# EAGLE schematic Mayfly_v1p0_revA3_public (EAGLE 9.6.2)
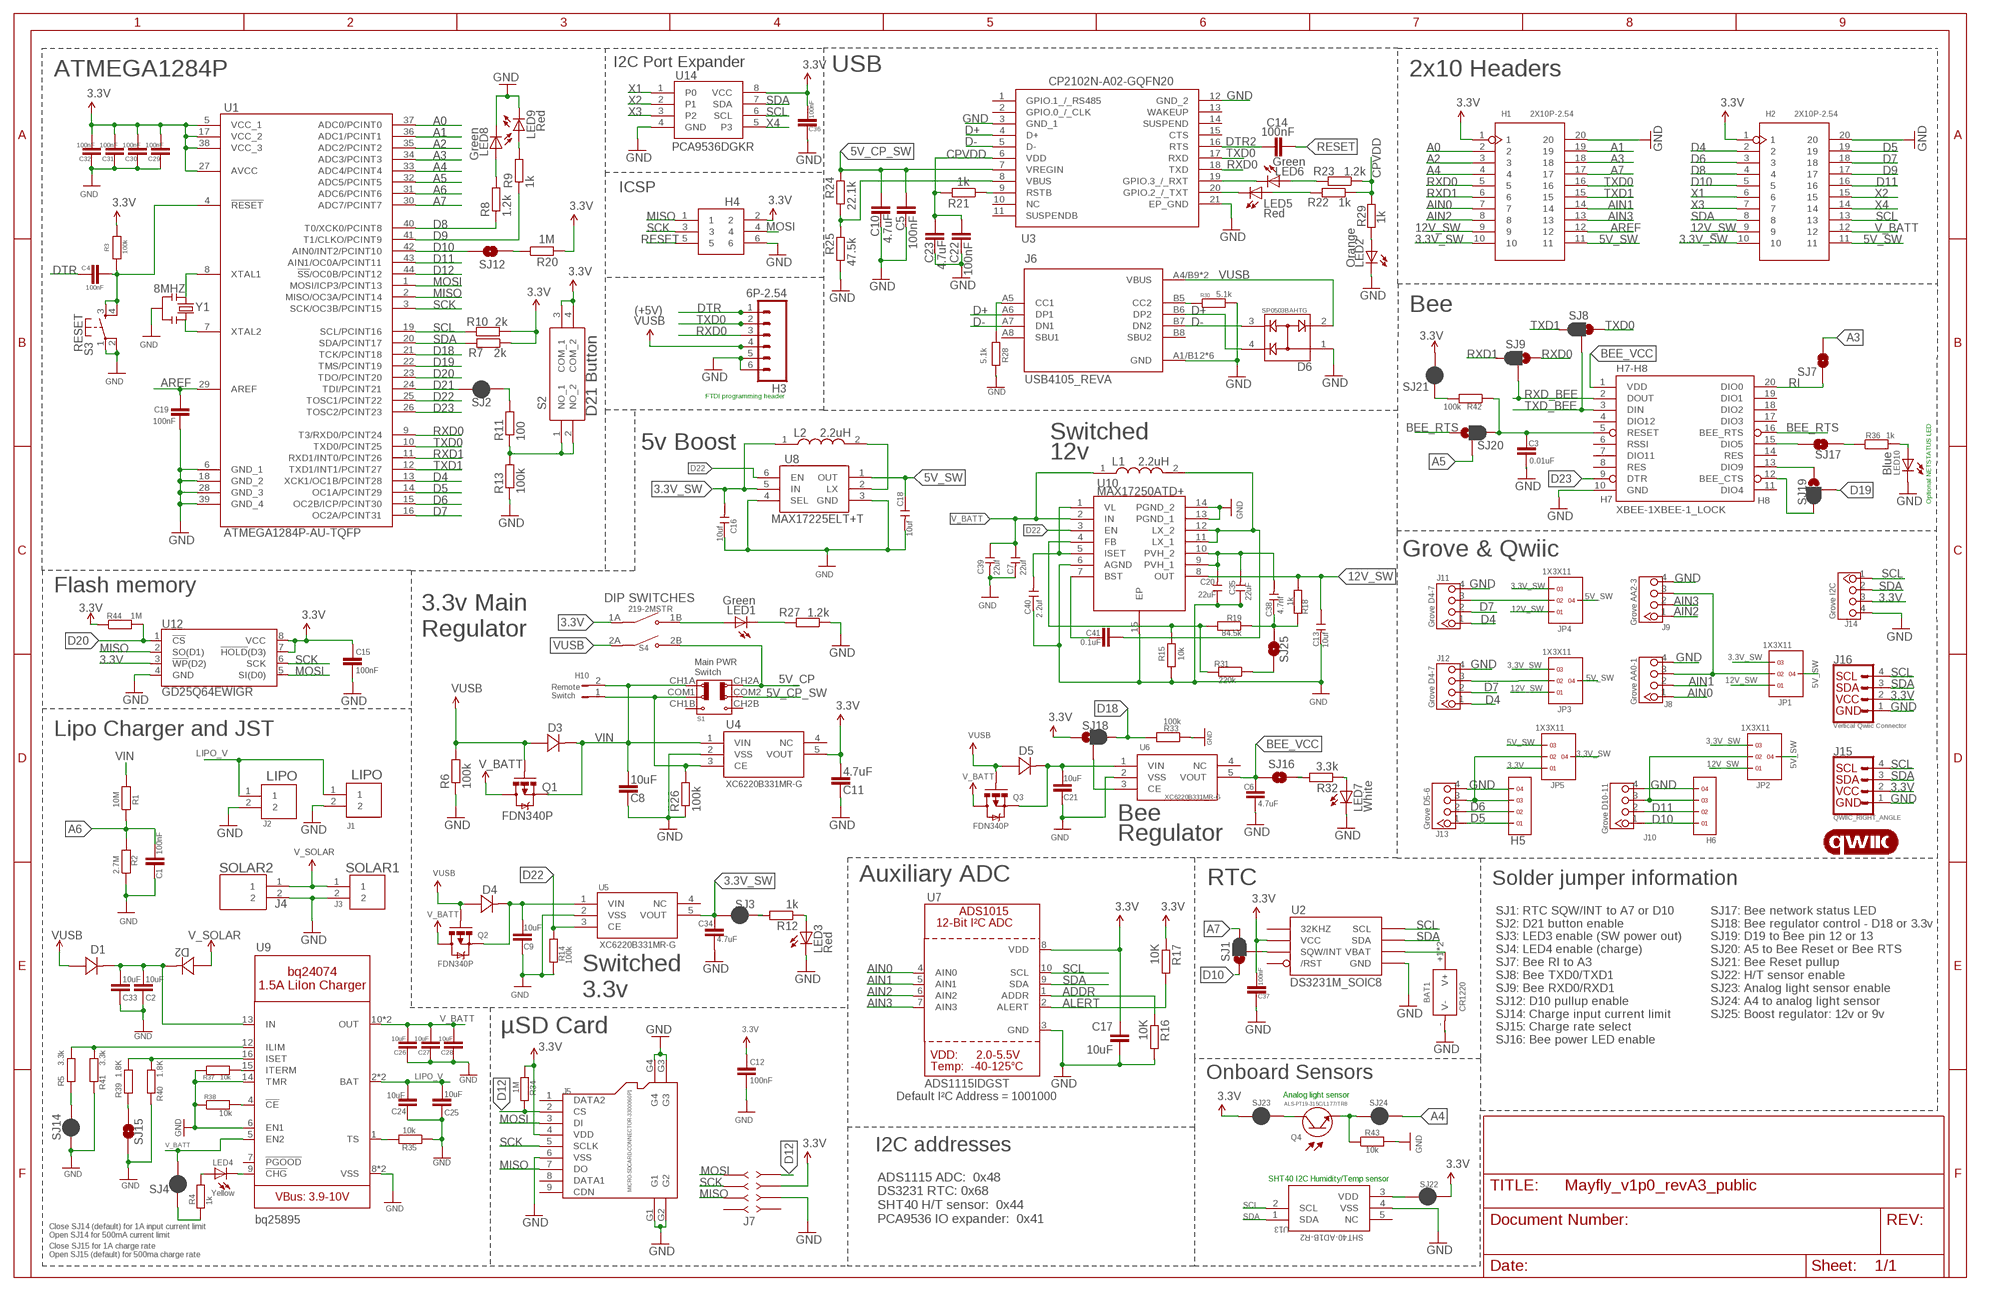
[diagram p0: schematic, sheet 1]

## Parts
BAT1  CR1220  DIP-BATTERY-CELL-HOLDER(1220)  [BAT2P-13.5-CR1220]
C1  100nF  C_0603  [C0603]
C2  10uF  C_0603  [C0603]
C3  0.01uF  C_0603  [C0603]
C4  100nF  C_0603  [C0603]
C5  100nF  C_0603  [C0603]
C6  4.7uF  C_0603  [C0603]
C7  22uf  CERAMIC-22UF-6.3V-20%-X5R(0805)  [C0805]
C8  10uF  C_0603  [C0603]
C9  10uF  C_0603  [C0603]
C10  4.7uF  C_0603  [C0603]
C11  4.7uF  C_0603  [C0603]
C12  100nF  C_0603  [C0603]
C13  10uf  CERAMIC-10UF-25V-10%-X5R(0805)  [C0805]
C14  100nF  C_0603  [C0603]
C15  100nF  C_0402  [C0402]
C16  10uf  CERAMIC-10UF-10V-10%-X5R(0603)  [C0603]
C17  10uF  C_0603  [C0603]
C18  10uf  CERAMIC-10UF-10V-10%-X5R(0603)  [C0603]
C19  100nF  C_0402  [C0402]
C20  22uF  CERAMIC-22UF-16V-10%-X7R(1206)  [C1206]
C21  10uF  C_0603  [C0603]
C22  100nF  C_0603  [C0603]
C23  4.7uF  C_0603  [C0603]
C24  10uF  C_0603  [C0603]
C25  10uF  C_0603  [C0603]
C26  10uF  C_0603  [C0603]
C27  10uF  C_0603  [C0603]
C28  10uF  C_0603  [C0603]
C29  100nF  C_0603  [C0603]
C30  100nF  C_0603  [C0603]
C31  100nF  C_0603  [C0603]
C32  100nF  C_0603  [C0603]
C33  10uF  C_0603  [C0603]
C34  4.7uF  C_0603  [C0603]
C35  22uF  CERAMIC-22UF-16V-10%-X7R(1206)  [C1206]
C36  100nF  C_0603  [C0603]
C37  100nF  C_0603  [C0603]
C38  4.7nf  CERAMIC-4.7NF-50V-10%-X7R(0603)  [C0603]
C39  22uf  CERAMIC-22UF-6.3V-20%-X5R(0805)  [C0805]
C40  2.2uf  CERAMIC-2.2UF-25V-10%-X7R(0805)  [C0805]
C41  0.1uF  C_0402  [C0402]
D1  MSS2P2-M3/89A  [DIODE_MSP3V3]
D2  MSS2P2-M3/89A  [DIODE_MSP3V3]
D3  MSS2P2-M3/89A  [DIODE_MSP3V3]
D4  MSS2P2-M3/89A  [DIODE_MSP3V3]
D5  MSS2P2-M3/89A  [DIODE_MSP3V3]
D6  SP0503BAHTG  [SOT143]
H1  2X10P-2.54  DIP-BLACK-FEMALE-HEADER(2X10P-2.54)-2.54  [H2X10-2.54]
H2  2X10P-2.54  DIP-BLACK-FEMALE-HEADER(2X10P-2.54)-2.54  [H2X10-2.54]
H3  6P-2.54  M06FEMALE_LOCK  [1X06_FEMALE_LOCK.010]
H4  FTSH-103-01-F-D  [FTSH-103-XX-YYY]
H5  1X4  [1X4]
H6  1X4  [1X4]
H7-H8  XBEE-1XBEE-1_LOCK  [XBEE-1_LOCK]
H10  JUMPER-PTH-2-NO  [PTH-JUMPER-2-NO_NO_SILK]
J1  JST_EPH_2PIN  [JST_EPH_B2B-PH-K-S]
J2  JST_EPH_2PIN  [JST_EPH_B2B-PH-K-S]
J3  JST_EPH_2PIN  [JST_EPH_B2B-PH-K-S]
J4  1778557  [SHDR2W70P0X250_1X2_670X500X765]
J5  MICRO-SDCARD-CONNECTOR-3300060P1  [9P-SMD-W-RING]
J6  USB4105_REVA  [GCT_USB4105_REVA]
J7  79107-08_S  [79107-08]
J8  Grove AA0-1  GROVE-CONNECTOR-DIP(4P-2.0)  [HW4-2.0]
J9  Grove AA2-3  GROVE-CONNECTOR-DIP(4P-2.0)  [HW4-2.0]
J10  Grove D10-11  GROVE-CONNECTOR-DIP(4P-2.0)  [HW4-2.0]
J11  Grove D4-7  GROVE-CONNECTOR-DIP(4P-2.0)  [HW4-2.0]
J12  Grove D4-7  GROVE-CONNECTOR-DIP(4P-2.0)  [HW4-2.0]
J13  Grove D5-6  GROVE-CONNECTOR-DIP(4P-2.0)  [HW4-2.0]
J14  Grove I2C  GROVE-CONNECTOR-DIP(4P-2.0)  [HW4-2.0]
J15  QWIIC_RIGHT_ANGLE  QWIIC_CONNECTORJS-1MM  [JST04_1MM_RA]
J16  Vertical Qwiic Connector  QWIIC_CONNECTOR  [JST04_1MM_VERT]
JP1  1X3X11  1X3X11X3X1  [1X3]
JP2  1X3X11  1X3X11X3X1  [1X3]
JP3  1X3X11  1X3X11X3X1  [1X3]
JP4  1X3X11  1X3X11X3X1  [1X3]
JP5  1X3X11  1X3X11X3X1  [1X3]
L1  2.2uH  DFE201610E-2R2M=P2  [1285ASH1R0MP2]
L2  2.2uH  DFE201610E-2R2M=P2  [1285ASH1R0MP2]
LED1  Green  LED0603  [LED-0603]
LED2  Orange  LED0603  [LED-0603]
LED3  Red  LED0603  [LED-0603]
LED4  Yellow  LED0603  [LED-0603]
LED5  Red  LED0603  [LED-0603]
LED6  Green  LED0603  [LED-0603]
LED7  White  LED0603  [LED-0603]
LED8  Green  LED0603  [LED-0603]
LED9  Red  LED0603  [LED-0603]
LED10  Blue  LED0603  [LED-0603]
LOGO4  QWIIC_LOGO_5MM  [QWIIC_5MM]
Q1  FDN340P  MOSFET-P-CHANNELSMALL  [SOT23-S-PADS]
Q2  FDN340P  MOSFET-P-CHANNELSMALL  [SOT23-S-PADS]
Q3  FDN340P  MOSFET-P-CHANNELSMALL  [SOT23-S-PADS]
Q4  ALS-PT19-315C/L177/TR8  [XDCR_ALS-PT19-315C/L177/TR8]
R1  10M  R_0402  [R0402]
R2  2.7M  R_0402  [R0402]
R3  100k  R_0603  [R0603]
R4  1k  R_0402  [R0402]
R5  3.3k  R_0402  [R0402]
R6  100k  R_0402  [R0402]
R7  2k  R_0603  [R0603]
R8  1.2k  R_0402  [R0402]
R9  1k  R_0402  [R0402]
R10  2k  R_0603  [R0603]
R11  100  R_0402  [R0402]
R12  1k  R_0402  [R0402]
R13  100k  R_0402  [R0402]
R14  100k  R_0402  [R0402]
R15  10k  R_0402  [R0402]
R16  10K  R_0402  [R0402]
R17  10K  R_0402  [R0402]
R18  1k  R_0402  [R0402]
R19  84.5k  R_0402  [R0402]
R20  1M  R_0603  [R0603]
R21  1k  R_0402  [R0402]
R22  1k  R_0402  [R0402]
R23  1.2k  R_0402  [R0402]
R24  22.1k  R_0402  [R0402]
R25  47.5k  R_0402  [R0402]
R26  100k  R_0603  [R0603]
R27  1.2k  R_0402  [R0402]
R28  5.1k  R_0402  [R0402]
R29  1k  R_0402  [R0402]
R30  5.1k  R_0402  [R0402]
R31  220k  R_0402  [R0402]
R32  3.3k  R_0402  [R0402]
R33  100k  R_0402  [R0402]
R34  1M  R_0402  [R0402]
R35  10k  R_0402  [R0402]
R36  1k  R_0402  [R0402]
R37  10k  R_0402  [R0402]
R38  10k  R_0402  [R0402]
R39  1.8K  R_0402  [R0402]
R40  1.8K  R_0402  [R0402]
R41  3.3k  R_0402  [R0402]
R42  100k  R_0402  [R0402]
R43  10k  R_0402  [R0402]
R44  1M  R_0402  [R0402]
S1  SWITCH-2CH-6P-3010010P1  [6P-2CH-2.54-9.1X3.5X3.2+2H]
S2  PTS647SK38SMTR2LFS  [PTS647SK38SMTR2LFS]
S3  MOMENTARY-SWITCH-SPST-2-SMD-4.6X2.8MM  [TACTILE_SWITCH_SMD_4.6X2.8MM]
S4  219-2MSTR  [SW_219-2MSTR]
SJ1  JUMPER-SMT_3_1-NC_PASTE_SILK  [SMT-JUMPER_3_1-NC_PASTE_SILK]
SJ2  JUMPER-SMT_2_NC_PASTE_SILK  [SMT-JUMPER_2_NC_PASTE_SILK]
SJ3  JUMPER-SMT_2_NC_PASTE_SILK  [SMT-JUMPER_2_NC_PASTE_SILK]
SJ4  JUMPER-SMT_2_NC_PASTE_SILK  [SMT-JUMPER_2_NC_PASTE_SILK]
SJ7  JUMPER-SMT_2_NO_SILK  [SMT-JUMPER_2_NO_SILK]
SJ8  JUMPER-SMT_3_1-NC_PASTE_SILK  [SMT-JUMPER_3_1-NC_PASTE_SILK]
SJ9  JUMPER-SMT_3_1-NC_PASTE_SILK  [SMT-JUMPER_3_1-NC_PASTE_SILK]
SJ12  SOLDERJUMPERNO  [SJ_2S-NO]
SJ14  JUMPER-SMT_2_NC_PASTE_SILK  [SMT-JUMPER_2_NC_PASTE_SILK]
SJ15  JUMPER-SMT_2_NO_SILK  [SMT-JUMPER_2_NO_SILK]
SJ16  JUMPER-SMT_2_NO_SILK  [SMT-JUMPER_2_NO_SILK]
SJ17  JUMPER-SMT_2_NO_SILK  [SMT-JUMPER_2_NO_SILK]
SJ18  JUMPER-SMT_3_1-NC_PASTE_SILK  [SMT-JUMPER_3_1-NC_PASTE_SILK]
SJ19  JUMPER-SMT_3_1-NC_PASTE_SILK  [SMT-JUMPER_3_1-NC_PASTE_SILK]
SJ20  JUMPER-SMT_3_1-NC_PASTE_SILK  [SMT-JUMPER_3_1-NC_PASTE_SILK]
SJ21  JUMPER-SMT_2_NC_PASTE_SILK  [SMT-JUMPER_2_NC_PASTE_SILK]
SJ22  JUMPER-SMT_2_NC_PASTE_SILK  [SMT-JUMPER_2_NC_PASTE_SILK]
SJ23  JUMPER-SMT_2_NC_PASTE_SILK  [SMT-JUMPER_2_NC_PASTE_SILK]
SJ24  JUMPER-SMT_2_NC_PASTE_SILK  [SMT-JUMPER_2_NC_PASTE_SILK]
SJ25  JUMPER-SMT_2_NO_SILK  [SMT-JUMPER_2_NO_SILK]
U1  ATMEGA1284P-AU-TQFP  [QFP80P1200X1200X120-44N]
U2  DS3231M_SOIC8  [SO8]
U3  CP2102N-A02-GQFN20  [CP2102NA02GQFN20]
U4  XC6220B331MR-G  [SOT95P280X130-5N]
U5  XC6220B331MR-G  [SOT95P280X130-5N]
U6  XC6220B331MR-G  [SOT95P280X130-5N]
U7  ADS1115IDGST  ADC_ADS1015  [MSOP10]
U8  MAX17225ELT+T  [MAX17225ELTT]
U9  ADAFRUIT_POWER_BQ24074  [ADAFRUIT_POWER_QFN16_3MM]
U10  MAX17250ATD+  [SON40P300X300X80-15N]
U12  GD25Q64EWIGR  W25Q32FVZP  [WSON8-6X5MM]
U13  SHT40-AD1B-R2  [SHT4X_SEN]
U14  PCA9536DGKR  [SOP65P490X110-8N]
Y1  8MHZ  SMD-RESONATOR-8MHZ-33PF-0.1%(3P-3.2X1.3MM)  [X3-SMD-3.6X1.3X0.8MM]

## Nets
3.3V: C11.2 C12.2 C15.2 C17.1 C29.2 C30.2 C31.2 C32.2 C36.2 C37.2 H1.1 H2.1 H4.2 J5.4(VDD) J7.3 J14.3 J15.2 J16.2 JP5.1 R3.2 R7.1 R10.2 R17.1 R20.2 R34.1 R44.1 S2.3(COM_1) S2.4(COM_2) S4.1A(COM1) SJ18.1 SJ21.2 SJ22.1 SJ23.1 U1.5(VCC_1) U1.17(VCC_2) U1.27(AVCC) U1.38(VCC_3) U2.2(VCC) U4.5(VOUT) U7.8(VDD) U12.3(!WP!(D2)) U12.7(!HOLD!(D3)) U12.8(VCC) U14.8(VCC)
3.3V_SW: C16.2 C34.2 H1.10 H2.10 JP1.3 JP2.3 JP3.3 JP4.3 JP5.4 L2.1 SJ3.1 U5.5(VOUT) U8.5(IN)
5V_CP: S1.CH2A S4.2B(NO2)
5V_CP_SW: C5.2 C10.2 R24.2 S1.COM2 U3.7(VREGIN)
5V_SW: C18.1 H1.11 H2.11 JP1.4 JP2.4 JP3.4 JP4.4 JP5.3 U8.1(OUT)
12V_SW: C13.1 H1.9 H2.9 JP1.1 JP2.1 JP3.1 JP4.1 R18.1 U10.8(OUT)
A0: H1.2 U1.37(ADC0/PCINT0)
A1: H1.19 U1.36(ADC1/PCINT1)
A2: H1.3 U1.35(ADC2/PCINT2)
A3: H1.18 SJ7.2 U1.34(ADC3/PCINT3)
A4: H1.4 SJ24.2 U1.33(ADC4/PCINT4)
A5: SJ20.2 U1.32(ADC5/PCINT5)
A6: C1.2 R1.1 R2.2 U1.31(ADC6/PCINT6)
A7: H1.17 SJ1.3 U1.30(ADC7/PCINT7)
ADDR: R16.1 U7.1(ADDR)
AIN0: H1.7 J8.1 U7.4(AIN0)
AIN1: H1.14 J8.2 U7.5(AIN1)
AIN2: H1.8 J9.1 U7.6(AIN2)
AIN3: H1.13 J9.2 U7.7(AIN3)
ALERT: R17.2 U7.2(ALERT)
AREF: C19.2 H1.12 U1.29(AREF)
BEE_RTS: H7-H8.16(BEE_RTS) SJ20.1
BEE_VCC: C6.2 H7-H8.1(VDD) SJ16.1 U6.5(VOUT)
BQ_IN: C2.2 C33.2 D1.1 D2.1 U9.13(IN)
C: U1.8(XTAL1) Y1.1
C_N: U1.7(XTAL2) Y1.3
CPVDD: C22.2 C23.2 R21.2 R22.1 R23.1 R29.1 U3.6(VDD)
D4: H2.2 J11.1 J12.1 U1.13(XCK1/OC1B/PCINT28)
D5: H2.19 H5.1 J13.1 U1.14(OC1A/PCINT29)
D6: H2.3 H5.2 J13.2 U1.15(OC2B/ICP/PCINT30)
D7: H2.18 J11.2 J12.2 U1.16(OC2A/PCINT31)
D8: H2.4 R8.1 U1.40(T0/XCK0/PCINT8)
D9: H2.17 R9.1 U1.41(T1/CLKO/PCINT9)
D10: H2.5 H6.1 J10.1 SJ1.1 SJ12.1 U1.42(AIN0/INT2/PCINT10)
D11: H2.16 H6.2 J10.2 U1.43(AIN1/OC0A/PCINT11)
D12: J5.2(CS) J7.1 R34.2 U1.44(!SS!/OC0B/PCINT12)
D18: R33.2 SJ18.3 U1.21(TCK/PCINT18)
D19: SJ19.2 U1.22(TMS/PCINT19)
D20: R44.2 U1.23(TDO/PCINT20) U12.1(!CS!)
D21: SJ2.2 U1.24(TDI/PCINT21)
D22: R14.2 U1.25(TOSC1/PCINT22) U5.3(CE) U8.6(EN) U10.3(EN)
D23: H7-H8.9(DTR) U1.26(TOSC2/PCINT23)
D+: D6.4 J6.A6(DP1) J6.B6(DP2) U3.4(D+)
D-: D6.3 J6.A7(DN1) J6.B7(DN2) U3.5(D-)
DTR: C4.1 H3.1
DTR2: C14.2 U3.16(RTS)
GND: BAT1.-(V-) C1.1 C2.1 C3.1 C5.1 C6.1 C7.2 C8.1 C9.1 C10.1 C11.1 C12.1 C13.2 C15.1 C16.1 C17.2 C18.2 C19.1 C20.1 C21.1 C22.1 C23.1 C24.1 C25.1 C26.1 C27.1 C28.1 C29.1 C30.1 C31.1 C32.1 C33.1 C34.1 C35.1 C36.1 C37.1 C39.2 C40.1 D6.1 H1.20 H2.20 H3.5 H3.6 H4.6 H5.4 H6.4 H7-H8.10(GND) J1.2 J2.2 J3.2 J4.2 J5.6(VSS) J5.G1 J5.G2 J5.G3 J5.G4 J6.A1/B12(GND) J6.B1/A12(GND) J6.G1(GND) J6.G2(GND) J6.G3(GND) J6.G4(GND) J7.5 J8.4 J9.4 J10.4 J11.4 J12.4 J13.4 J14.4 J15.1 J16.1 LED2.C LED3.C LED7.C LED8.C LED9.C LED10.C R2.1 R6.1 R13.1 R14.1 R15.1 R16.2 R25.1 R26.1 R27.1 R28.2 R30.2 R33.1 R35.1 R37.1 R38.1 R40.1 R41.1 R43.2 S3.1 S3.2 SJ14.2 SJ15.1 U1.6(GND_1) U1.18(GND_2) U1.28(GND_3) U1.39(GND_4) U2.5(GND) U3.3(GND_1) U3.12(GND_2) U3.21(EP_GND) U4.2(VSS) U5.2(VSS) U6.2(VSS) U7.3(GND) U8.3(GND) U8.4(SEL) U9.6(EN1) U9.8(VSS) U9.14(TMR) U9.THERMAL(VSS) U10.6(AGND) U10.13(PGND_1) U10.14(PGND_2) U10.15(EP) U12.4(GND) U13.4(VSS) U14.4(GND) Y1.2
LIPO_V: C24.2 C25.2 J1.1 J2.1 U9.2(BAT) U9.3(BAT)
MISO: H4.1 J5.7(DO) J7.6 U1.2(MISO/OC3A/PCINT14) U12.2(SO(D1))
MOSI: H4.4 J5.3(DI) J7.2 U1.1(MOSI/ICP3/PCINT13) U12.5(SI(D0))
N$1: R20.1 SJ12.2
N$2: H10.1 R26.2 S1.COM1 U4.3(CE)
N$3: R12.2 SJ3.2
N$4: LED3.A R12.1
N$5: R11.1 R13.2 S2.1(NO_1) S2.2(NO_2)
N$6: J8.3 J9.3 JP1.2
N$7: R21.1 U3.9(RSTB)
N$8: R15.2 R19.2 R31.2 U10.4(FB)
N$9: SJ18.2 U6.3(CE)
N$10: SJ1.2 U2.3(SQW/INT)
N$11: J6.A5(CC1) R28.1
N$13: LED4.A R4.2
N$14: R39.1 SJ15.2
N$15: H7-H8.13(DIO9) SJ19.1
N$16: R4.1 SJ4.2
N$17: C40.2 U10.1(VL) U10.5(ISET)
N$19: R5.1 SJ14.1
N$20: R11.2 SJ2.1
N$21: J11.3 JP4.2
N$22: LED1.C R27.2
N$23: H7-H8.12(BEE_CTS) SJ19.3
N$24: C3.2 H7-H8.5(RESET) R42.1 SJ20.3
N$25: C9.2 D4.1 Q2.2(S) U5.1(VIN)
N$26: C20.2 C35.2 C38.2 U10.9(PVH_1) U10.10(PVH_2)
N$27: H6.3 J10.3 JP2.2
N$28: LED1.A S4.1B(NO1)
N$29: C41.1 L1.2 U10.11(LX_1) U10.12(LX_2)
N$31: H7-H8.15(DIO5) SJ17.2
N$32: J6.B5(CC2) R30.1
N$33: LED5.C U3.20(GPIO.2_/_TXT)
N$34: LED6.C U3.19(GPIO.3_/_RXT)
N$35: LED5.A R22.2
N$36: LED6.A R23.2
N$37: LED2.A R29.2
N$38: LED9.A R9.2
N$39: BAT1.+1(V+) BAT1.+2(V+) U2.6(VBAT)
N$40: LED8.A R8.2
N$41: LED7.A R32.1
N$42: R32.2 SJ16.2
N$43: C21.2 D5.1 Q3.2(S) U6.1(VIN)
N$44: LED10.A R36.2
N$45: R35.2 U9.1(TS)
N$46: LED4.C U9.9(!CHG)
N$47: R42.2 SJ21.1
N$48: R5.2 R41.2 U9.12(ILIM)
N$49: R37.2 U9.15(ITERM)
N$50: R38.2 U9.4(!CE)
N$51: R39.2 R40.2 U9.16(ISET)
N$52: R36.1 SJ17.1
N$53: SJ22.2 U13.3(VDD)
N$54: Q4.2(E) R43.1 SJ24.1
N$55: Q4.1(C) SJ23.2
N$56: H5.3 J13.3 JP5.2
N$58: C38.1 R18.2 R19.1 SJ25.2
N$62: C41.2 U10.7(BST)
N$65: L2.2 U8.2(LX)
N$66: J12.3 JP3.2
N$67: R31.1 SJ25.1
RESET: C4.2 C14.1 H4.5 R3.1 S3.3 S3.4 U1.4(!RESET)
RI: H7-H8.20(DIO0) SJ7.1
RXD0: H1.5 H3.3 SJ9.1 U1.9(T3/RXD0/PCINT24) U3.18(TXD)
RXD1: H1.6 SJ9.3 U1.11(RXD1/INT0/PCINT26)
RXD_BEE: H7-H8.2(DOUT) SJ9.2
SCK: H4.3 J5.5(SCLK) J7.4 U1.3(SCK/OC3B/PCINT15) U12.6(SCK)
SCL: H2.13 J14.1 J15.4 J16.4 R10.1 U1.19(SCL/PCINT16) U2.8(SCL) U7.10(SCL) U13.2(SCL) U14.6(SCL)
SDA: H2.8 J14.2 J15.3 J16.3 R7.2 U1.20(SDA/PCINT17) U2.7(SDA) U7.9(SDA) U13.1(SDA) U14.7(SDA)
TXD0: H1.16 H3.2 SJ8.1 U1.10(TXD0/PCINT25) U3.17(RXD)
TXD1: H1.15 SJ8.3 U1.12(TXD1/INT1/PCINT27)
TXD_BEE: H7-H8.3(DIN) SJ8.2
V_BATT: C7.1 C26.2 C27.2 C28.2 C39.1 H2.12 L1.1 Q1.3(D) Q2.3(D) Q3.3(D) SJ4.1 U9.5(EN2) U9.10(OUT) U9.11(OUT) U10.2(IN)
V_SOLAR: D2.2 J3.1 J4.1
VBS: R24.1 R25.2 U3.8(VBUS)
VIN: C8.2 D3.1 H10.2 Q1.2(S) R1.2 S1.CH1A U4.1(VIN)
VUSB: D1.2 D3.2 D4.2 D5.2 D6.2 H3.4 J6.A4/B9(VBUS) J6.B4/A9(VBUS) Q1.1(G) Q2.1(G) Q3.1(G) R6.2 S4.2A(COM2)
X1: H2.6 U14.1(P0)
X2: H2.15 U14.2(P1)
X3: H2.7 U14.3(P2)
X4: H2.14 U14.5(P3)
Unconnected: H7-H8.4(DIO12) H7-H8.6(RSSI) H7-H8.7(DIO11) H7-H8.8(RES) H7-H8.11(DIO4) H7-H8.14(RES) H7-H8.17(DIO3) H7-H8.18(DIO2) H7-H8.19(DIO1) J5.1(DATA2) J5.8(DATA1) J5.9(CDN) J6.A8(SBU1) J6.B8(SBU2) J7.7 J7.8 S1.CH1B S1.CH2B U2.1(32KHZ) U2.4(/RST) U3.1(GPIO.1_/_RS485) U3.2(GPIO.0_/_CLK) U3.10(NC) U3.11(SUSPENDB) U3.13(WAKEUP) U3.14(SUSPEND) U3.15(CTS) U4.4(NC) U5.4(NC) U6.4(NC) U9.7(!PGOOD) U13.5(NC)

## Notes on the sheet
- I2C Port Expander | USB | 2x10 Headers
- ATMEGA1284P
- ICSP
- Bee
- (+5V)
- D21 Button
- FTDI programming header
- Switched 
  12v
- 5v Boost
- H7 | H8
- Optional NETSTATUS LED
- Grove & Qwiic
- Flash memory
- 3.3v Main 
  Regulator
- DIP SWITCHES
- Main PWR
  Switch
- Remote
  Switch
- Lipo Charger and JST
- LIPO | LIPO
- Bee 
  Regulator
- Auxiliary ADC | RTC | Solder jumper information
- SOLAR2 | SOLAR1
- SJ1: RTC SQW/INT to A7 or D10
  SJ2: D21 button enable
  SJ3: LED3 enable (SW power out)
  SJ4: LED4 enable (charge)
  SJ7: Bee RI to A3
  SJ8: Bee TXD0/TXD1
  SJ9: Bee RXD0/RXD1
  SJ12: D10 pullup enable
  SJ14: Charge input current limit
  SJ15: Charge rate select
  SJ16: Bee power LED enable
- SJ17: Bee network status LED
  SJ18: Bee regulator control - D18 or 3.3v
  SJ19: D19 to Bee pin 12 or 13
  SJ20: A5 to Bee Reset or Bee RTS
  SJ21: Bee Reset pullup
  SJ22: H/T sensor enable
  SJ23: Analog light sensor enable
  SJ24: A4 to analog light sensor
  SJ25: Boost regulator: 12v or 9v
- Switched 
  3.3v
- µSD Card
- Onboard Sensors
- Default I²C Address = 1001000
- Analog light sensor
- I2C addresses
- SHT40 I2C Humidity/Temp sensor
- ADS1115 ADC:  0x48
  DS3231 RTC: 0x68
  SHT40 H/T sensor:  0x44
  PCA9536 IO expander:  0x41
- Close SJ14 (default) for 1A input current limit
  Open SJ14 for 500mA current limit
- Close SJ15 for 1A charge rate
  Open SJ15 (default) for 500ma charge rate

## Library data of the parts
BAT1 = Mayfly_v0p5_order11:DIP-BATTERY-CELL-HOLDER(1220): 320170002; VALUE: cr1220
C1-C6 C8-C12 C14 C15 C17 C19 C21-C34 C36 C37 C41 = gknff:C
C7 C39 = OPL_Capacitor:CERAMIC-22UF-6.3V-20%-X5R(0805): 302010171; MPN: CC0805MKX5R5BB226
C13 = OPL_Capacitor:CERAMIC-10UF-25V-10%-X5R(0805): 302010178; MPN: CC0805KKX5R8BB106
C16 C18 = OPL_Capacitor:CERAMIC-10UF-10V-10%-X5R(0603): 302010103; MPN: CC0603KRX5R6BB106
C20 C35 = OPL_Capacitor:CERAMIC-22UF-16V-10%-X7R(1206): 302010182
C38 = OPL_Capacitor:CERAMIC-4.7NF-50V-10%-X7R(0603): 302010144; MPN: CC0603KRX7R9BB472
C40 = OPL_Capacitor:CERAMIC-2.2UF-25V-10%-X7R(0805): 302010148; MPN: CC0805KKX7R8BB225
D1-D5 = digikey:MSS2P2-M3/89A; BUILT_BY: EMA_UL_Team; MANUFACTURER_PART_NUMBER: MSS2P2-M3/89A; VENDOR: Vishay
D6 = SP0503BAHTG:SP0503BAHTG: TVS DIODE 5.5VWM 8.5VC SOT143; DESCRIPTION: 8.5V Clamp Ipp Tvs Diode Surface Mount SOT-143-4; DIGI-KEY_PART_NUMBER: F2715CT-ND; MF: Littelfuse Inc.; MP: SP0503BAHTG; PACKAGE: SOT-143 Littelfuse; PURCHASE-URL: https://pricing.snapeda.com/search/part/SP0503BAHTG/?ref=eda
H1 H2 = Seeed-OPL-Connector:DIP-BLACK-FEMALE-HEADER(2X10P-2.54): 320030090; MPN: F185-1210A0BA1
H3 = SparkFun-Connectors:M06: Header 6 Standard 6-pin 0.1" header. Use with straight break away headers (SKU : PRT-00116), right angle break away headers (PRT-00553), swiss pins (PRT-00743), machine pins (PRT-00117), and female headers (PRT-00115). Molex polarized connector foot print use with SKU : PRT-08094 with associated crimp pins and housings. NOTES ON THE VARIANTS LOCK and LOCK_LONGPADS... This footprint was designed to help hold the alignment of a through-hole component (i.e. 6-pin header) while soldering it into place. You may notice that each hole has been shifted either up or down by 0.005 of an inch from it's more standard position (which is a perfectly straight line). This slight alteration caused the pins (the squares in the middle) to touch the edges of the holes. Because they are alternating, it causes a "brace" to hold the component in place. 0.005 has proven to be the perfect amount of "off-center" position when using our standard breakaway headers. Although looks a little odd when you look at the bare footprint, once you have a header in there, the alteration is very hard to notice. Also,if you push a header all the way into place, it is covered up entirely on the bottom side. This idea of altering the position of holes to aid alignment will be further integrated into the Sparkfun Library for other footprints. It can help hold any component with 3 or more connection pins.
H4 = SamacSys_Parts:FTSH-103-01-F-D: 6 Position, High Reliability Header Strips, 0.050" pitch Source: Datasheet <http://suddendocs.samtec.com/prints/ftsh-1xx-xx-xxx-d-xxx-xx-mkt.pdf>; DESCRIPTION: 6 Position, High Reliability Header Strips, 0.050&quot; pitch; HEIGHT: mm; MANUFACTURER_NAME: SAMTEC; MANUFACTURER_PART_NUMBER: FTSH-103-01-F-D; MOUSER_PART_NUMBER: 200-FTSH10301FD; MOUSER_PRICE-STOCK: https://www.mouser.co.uk/ProductDetail/Samtec/FTSH-103-01-F-D/?qs=0lQeLiL1qyb7OHmlWV4egA%3D%3D
H5 H6 = headers(2mm):1X4
H7-H8 = SparkFun-RF:XBEE-1: Xbee module footprints SMT header is CONN-09042.
H10 = SparkFun-Passives:JUMPER-PTH-2-NO
J1-J3 = Daughterboard_XMEGA_A3BU_v1.0:JST_EPH_2PIN
J4 = SamacSys_Parts:1778557: Pluggable Terminal Blocks PTSM 0,5/ 2-HV-2,5 THR R32 Source: Datasheet <https://www.phoenixcontact.com/online/portal/us/pxc/product_detail_page/!ut/p/z1/3Vhbb9owFP4r6QNvNXYuTsKkPUBgpRQYDaEleYkcx1TeyKWJgY5fP6fQbqANHio0LcgivpzzHX_H-aKcwADOYZCSNX8igmcpWcqxH5ih1_F6vYlmql_vcQfddrHTGxqu2h9r8AEGMBAkgr5a9ZY8KkjxA_qrkqXVRM5juWRZNsZWNc>; DESCRIPTION: Pluggable Terminal Blocks PTSM 0,5/ 2-HV-2,5 THR R32; HEIGHT: 7.65mm; MANUFACTURER_NAME: Phoenix Contact; MANUFACTURER_PART_NUMBER: 1778557; MOUSER_PART_NUMBER: 651-1778557; MOUSER_PRICE-STOCK: https://www.mouser.co.uk/ProductDetail/Phoenix-Contact/1778557?qs=i0qWf6NAoDsKgznh0VD8iA%3D%3D
J5 = OPL Eagle Library:MICRO-SDCARD-CONNECTOR: Micro SD Card
J6 = USB4105_REVA:USB4105_REVA: USB Type C Receptacle for USB 2.0 SMT Type, PCB Top Mount; DESCRIPTION: USB-C (USB TYPE-C) USB 2.0 Receptacle Connector 24 (16+8 Dummy) Position Surface Mount, Right Angle; Through Hole; MF: Global Connector Technology; MP: USB4105; PACKAGE: Package
J7 = con-molex-milli-grid:79107-08_S: RECEPTACAL
J8-J14 = Seeed-OPL-Connector:GROVE-CONNECTOR-DIP(4P-2.0): 320110033; VALUE: 4P-2.0
J15 = SparkFun-Connectors:QWIIC_CONNECTOR: SparkFun I2C Standard Qwiic Connector An SMD 1mm pitch JST connector makes it easy and quick (get it? Qwiic?) to connect I2C devices to each other. The Qwiic system <http://www.sparkfun.com/qwiic> enables fast and solderless connection between popular platforms and various sensors and actuators. We carry 200mm <https://www.sparkfun.com/products/14204>, 100mm <https://www.sparkfun.com/products/14205>, 50mm <https://www.sparkfun.com/products/14206>, and breadboard friendly <https://www.sparkfun.com/products/14207> Qwiic cables. We also offer 10 pcs strips <https://www.sparkfun.com/products/14323> the SMD connectors.; PROD_ID: CONN-13694
J16 = SparkFun-Connectors:QWIIC_CONNECTOR: SparkFun I2C Standard Qwiic Connector An SMD 1mm pitch JST connector makes it easy and quick (get it? Qwiic?) to connect I2C devices to each other. The Qwiic system <http://www.sparkfun.com/qwiic> enables fast and solderless connection between popular platforms and various sensors and actuators. We carry 200mm <https://www.sparkfun.com/products/14204>, 100mm <https://www.sparkfun.com/products/14205>, 50mm <https://www.sparkfun.com/products/14206>, and breadboard friendly <https://www.sparkfun.com/products/14207> Qwiic cables. We also offer 10 pcs strips <https://www.sparkfun.com/products/14323> the SMD connectors.; PROD_ID: CONN-14483
JP1-JP5 = Mayfly_v0p5_order11:1X3X1
L1 L2 = SamacSys_Parts:DFE201610E-2R2M=P2: DFE201610E Series Inductor 2.2uH +/-20% 0806 (2016) Source: Datasheet <https://psearch.en.murata.com/inductor/product/DFE201610E-2R2M#.html>; DESCRIPTION: DFE201610E Series Inductor 2.2uH +/-20% 0806 (2016); HEIGHT: 1mm; MANUFACTURER_NAME: Murata Electronics; MANUFACTURER_PART_NUMBER: DFE201610E-2R2M=P2; MOUSER_PART_NUMBER: 81-DFE201610E-2R2MP2; MOUSER_PRICE-STOCK: https://www.mouser.co.uk/ProductDetail/Murata-Electronics/DFE201610E-2R2M%3dP2/?qs=AQlKX63v8Rv49b3hcvXgWQ%3D%3D
LED1-LED10 = SparkFun-LED:LED: LEDs Standard schematic elements and footprints for 5mm, 3mm, 1206, and 0603 sized LEDs. 5mm - Spark Fun Electronics SKU : COM-00529 (and others)
LOGO4 = SparkFun-Aesthetics:QWIIC_LOGO: Qwiic Logos for placement on schematic and PCB. The 5.5mm silk logo is best for placing next to Qwiic connector.
Q1-Q3 = gknff:MOSFET-P-CHANNEL
Q4 = ALS-PT19-315C_L177_TR8:ALS-PT19-315C/L177/TR8: Phototransistors 630nm 2-SMD, No Lead Check prices <https://pricing.snapeda.com/parts/ALS-PT19-315C/L177/TR8/Everlight/view-part?ref=eda>; AVAILABILITY: Good; DESCRIPTION: Phototransistors 630nm 2-SMD, No Lead; MF: Everlight; MP: ALS-PT19-315C/L177/TR8; PACKAGE: None; PRICE: None; PURCHASE-URL: https://pricing.snapeda.com/search/part/ALS-PT19-315C/L177/TR8/?ref=eda
R1-R44 = gknff:R
S1 = OPL:SWITCH-2CH-6P*: MS-22D18 G2 ROHS
S2 = SamacSys_Parts:PTS647SK38SMTR2LFS: Tactile Switches 50mA 12VDC, 2.5N 3.8mm H, G leads Source: Datasheet <https://www.ckswitches.com/media/2567/pts647.pdf>; DESCRIPTION: Tactile Switches 50mA 12VDC, 2.5N 3.8mm H, G leads; HEIGHT: 3.8mm; MANUFACTURER_NAME: C & K COMPONENTS; MANUFACTURER_PART_NUMBER: PTS647SK38SMTR2LFS; MOUSER_PART_NUMBER: 611-PTS647SK38SMTR2L; MOUSER_PRICE-STOCK: https://www.mouser.co.uk/ProductDetail/CK/PTS647SK38SMTR2LFS?qs=PqoDHHvF649Jgx1Ch2uMjg%3D%3D
S3 = SparkFun-Switches:MOMENTARY-SWITCH-SPST-2: Momentary Switch (Pushbutton) - SPST - Two Circuits Normally-open (NO) SPST momentary switches (buttons, pushbuttons). Schematic symbol includes two switch circuits. Variants SMD-4.6MMX2.8MM - 4.60mm x 2.80mm Tactile Momentary Button Switch - Used on SparkFun Pro Micro - RP2040 <https://www.sparkfun.com/products/17717> SMD-5.2MM - Mini Pushbutton Switch - SMD <https://www.sparkfun.com/products/8720> - Used on Arduino Pro Mini <https://www.sparkfun.com/products/11114>; PROD_ID: SWCH-15606
S4 = 219-2MSTR:219-2MSTR: Dip Switch SPST 2 Position Surface Mount Slide (Standard) Actuator 100mA 20VDC; DESCRIPTION: Dip Switch SPST 2 Position Surface Mount Slide (Standard) Actuator 100mA 20VDC; DIGI-KEY_PART_NUMBER: CT3114CT-ND; MF: CTS Electrocomponents; MP: 219-2MSTR; PACKAGE: None; PURCHASE-URL: https://pricing.snapeda.com/search/part/219-2MSTR/?ref=eda
SJ1 SJ8 SJ9 SJ18-SJ20 = SparkFun-Jumpers:JUMPER-SMT_3_1-NC_PASTE: Normally closed solder jumper (1 of 2 connections) This jumper has an aperture in the stencil to allow solder paste to bridge one of the two connections. One connection is normally closed (NC), while the other is normally open (NO). Wick off the solder to open the connection. Reapply solder to reclose the connection. Apply solder to the other side instead to change the current path.
SJ2-SJ4 SJ14 SJ21-SJ24 = SparkFun-Jumpers:JUMPER-SMT_2_NC_PASTE: Normally closed solder jumper This jumper has an aperture in the stencil to allow solder paste to bridge the split in the wire so it's normally closed (NC). Wick off the solder to open the connection. Reapply solder to reclose the connection.
SJ7 SJ15-SJ17 SJ25 = SparkFun-Jumpers:JUMPER-SMT_2_NO: Normally open jumper This jumper has two pads in close proximity to each other. Apply solder to close the connection. Round pads are easier to solder for beginners, but are a lot larger. SparkFun Product that uses the round pads: SparkFun EL Sequencer <https://www.sparkfun.com/products/12781>
SJ12 = SparkFun-Passives:SOLDERJUMPER: Solder Jumper Standard SMD solder jumper. Used to automate production. Two varients : Normally Open and Normally Closed are the same, but have different paste layers. NC will have a large amount of paste and should jumper during reflow.
U1 = Mayfly_v0p5_order11:ATMEGA1284P-AU-TQFP: ATMEGA1284P-AU, 8 bit AVR Microcontroller 20MHz 4, 128kb Flash, 16kb RAM, I2C SPI 44-Pin TQFP Source: Datasheet <http://www.atmel.com/Images/Atmel-8272-8-bit-AVR-microcontroller-ATmega164A_PA-324A_PA-644A_PA-1284_P_datasheet.pdf>; DESCRIPTION: ATMEGA1284P-AU, 8 bit AVR Microcontroller 20MHz 4, 128kb Flash, 16kb RAM, I2C SPI 44-Pin TQFP; HEIGHT: 1.2mm; MANUFACTURER_NAME: Microchip; MANUFACTURER_PART_NUMBER: ATMEGA1284P-AU; MOUSER_PART_NUMBER: 556-ATMEGA1284P-AU; MOUSER_PRICE-STOCK: https://www.mouser.co.uk/ProductDetail/Microchip-Technology-Atmel/ATMEGA1284P-AU?qs=K8BHR703ZXhSH38LfIFExQ%3D%3D
U2 = gknff:DS3231M
U3 = SamacSys_Parts:CP2102N-A02-GQFN20: USB Interface IC USB to UART bridge - QFN20 Source: Datasheet <https://www.silabs.com/documents/public/data-sheets/cp2102n-datasheet.pdf>; DESCRIPTION: USB Interface IC USB to UART bridge - QFN20; HEIGHT: 0.8mm; MANUFACTURER_NAME: Silicon Labs; MANUFACTURER_PART_NUMBER: CP2102N-A02-GQFN20; MOUSER_PART_NUMBER: 634-CP2102NA02GQFN20; MOUSER_PRICE-STOCK: https://www.mouser.co.uk/ProductDetail/Silicon-Labs/CP2102N-A02-GQFN20?qs=u16ybLDytRaG8WdlP0fT2g%3D%3D
U4-U6 = SamacSys_Parts:XC6220B331MR-G: TOREX - XC6220B331MR-G - IC, LDO, 1A, 3.3V, SOT-25 Source: Datasheet <https://media.digikey.com/pdf/Data Sheets/Torex/XC6220.pdf>; DESCRIPTION: TOREX - XC6220B331MR-G - IC, LDO, 1A, 3.3V, SOT-25; HEIGHT: 1.3mm; MANUFACTURER_NAME: Torex; MANUFACTURER_PART_NUMBER: XC6220B331MR-G; MOUSER_PART_NUMBER: 865-XC6220B331MR-G; MOUSER_PRICE-STOCK: https://www.mouser.co.uk/ProductDetail/Torex-Semiconductor/XC6220B331MR-G?qs=AsjdqWjXhJ8lRh0WBUyqoQ%3D%3D
U7 = microbuilder:ADC_ADS1015: ADS1015 - 12-bit 4-Channel I2C ADC with Internal PGA VDD: 2.0-5.5V Sampling Rate: 3.3ksps Gain Settings: 2/3, 1, 2, 4, 8, 16 I2C Address: ADDR low = 1001000x, ADDR high = 1001001x Internal Comparator The ADS1015 includes an internal comparator that can be set to output a high-level on ALERT when the conversion results exceeeds a pre-defined upper level, and will deassert itself when the level falls below a pre-defined lower threshold level. It can also be set to windowed mode where the ALERT pin will be asserted if the data exceeds the upper threshold or falls below the lower threshold.
U8 = SamacSys_Parts:MAX17225ELT+T: Switching Voltage Regulators 0.9V to 5V, 500mA Input Current Limit Ultra Low Power Boost Converter with True Shutdown Source: Datasheet <https://componentsearchengine.com/Datasheets/2/MAX17225ELT T.pdf>; DESCRIPTION: Switching Voltage Regulators 0.9V to 5V, 500mA Input Current Limit Ultra Low Power Boost Converter with True Shutdown; HEIGHT: 0.8mm; MANUFACTURER_NAME: Maxim Integrated; MANUFACTURER_PART_NUMBER: MAX17225ELT+T; MOUSER_PART_NUMBER: 700-MAX17225ELT+T; MOUSER_PRICE-STOCK: https://www.mouser.co.uk/ProductDetail/Maxim-Integrated/MAX17225ELT%2bT?qs=BZBei1rCqCBDzwgHHfDDQQ%3D%3D
U9 = SDH_Adafruit_BQ24074:ADAFRUIT_POWER_BQ24074
U10 = SamacSys_Parts:MAX17250ATD+: 2.7V to 18V Input, Boost Converter with 0.1uA True Shutdown, Short-Circuit Protection and Selectable Input Current Limit Source: Datasheet <https://datasheets.maximintegrated.com/en/ds/MAX17250.pdf>; DESCRIPTION: 2.7V to 18V Input, Boost Converter with 0.1uA True Shutdown, Short-Circuit Protection and Selectable Input Current Limit; HEIGHT: 0.8mm; MANUFACTURER_NAME: Maxim Integrated; MANUFACTURER_PART_NUMBER: MAX17250ATD+; MOUSER_PART_NUMBER: 700-MAX17250ATD+; MOUSER_PRICE-STOCK: https://www.mouser.co.uk/ProductDetail/Maxim-Integrated/MAX17250ATD%2b?qs=byeeYqUIh0N%2F4sj9NijIlg%3D%3D
U12 = SparkFun-IC-Memory:W25Q32FV: W25Q32FV 32Mb (4MB) Serial Flash Memory The W25Q32FV support the standard Serial Peripheral Interface (SPI), Dual/Quad I/O SPI as well as 2-clocks instruction cycle Quad Peripheral Interface (QPI). 104MHz, SPI, 8-SOIC-EIAJ Datasheet <http://www.winbond.com/resource-files/w25q32fv%20revh%20091613.pdf> SparkFun Products SparkFun Blynk Board - ESP8266 <https://www.sparkfun.com/products/13794> (WRL-13794); PROD_ID: NA-XXXXX; VALUE: W25Q32FV
U13 = SparkFun-Connectors:SHT40-AD1B-R2: SHT40; BUILT_BY: EMA_Cory; COPYRIGHT: Copyright (C) 2018 Accelerated Designs. All rights reserved; DATASHEET: https://www.mouser.com/datasheet/2/682/Sensirion_10272020_Datasheet_SHT4x-1919523.pdf; MANUFACTURER_PART_NUMBER: SHT40-AD1B-R2; SOURCELIBRARY: Add_to_database_2020-11-16; VENDOR: Sensirion
U14 = SamacSys_Parts:PCA9536DGKR: Remote 4-Bit I2C and SMBus I/O Expander With Configuration Registers Source: Datasheet <http://www.ti.com/lit/gpn/pca9536>; DESCRIPTION: Remote 4-Bit I2C and SMBus I/O Expander With Configuration Registers; HEIGHT: 1.1mm; MANUFACTURER_NAME: Texas Instruments; MANUFACTURER_PART_NUMBER: PCA9536DGKR; MOUSER_PART_NUMBER: 595-PCA9536DGKR; MOUSER_PRICE-STOCK: https://www.mouser.co.uk/ProductDetail/Texas-Instruments/PCA9536DGKR/?qs=aEuGZpxfbxWTHoUJSY9n7Q%3D%3D
Y1 = Seeed-OPL-crystal-osctllator:SMD-RESONATOR-8MHZ-33PF-0.1%(3P-3.2X1.3MM): 306030005; MPN: CSTCE8M00G15L99-R0